# EAGLE design working (EAGLE 7.7.0)
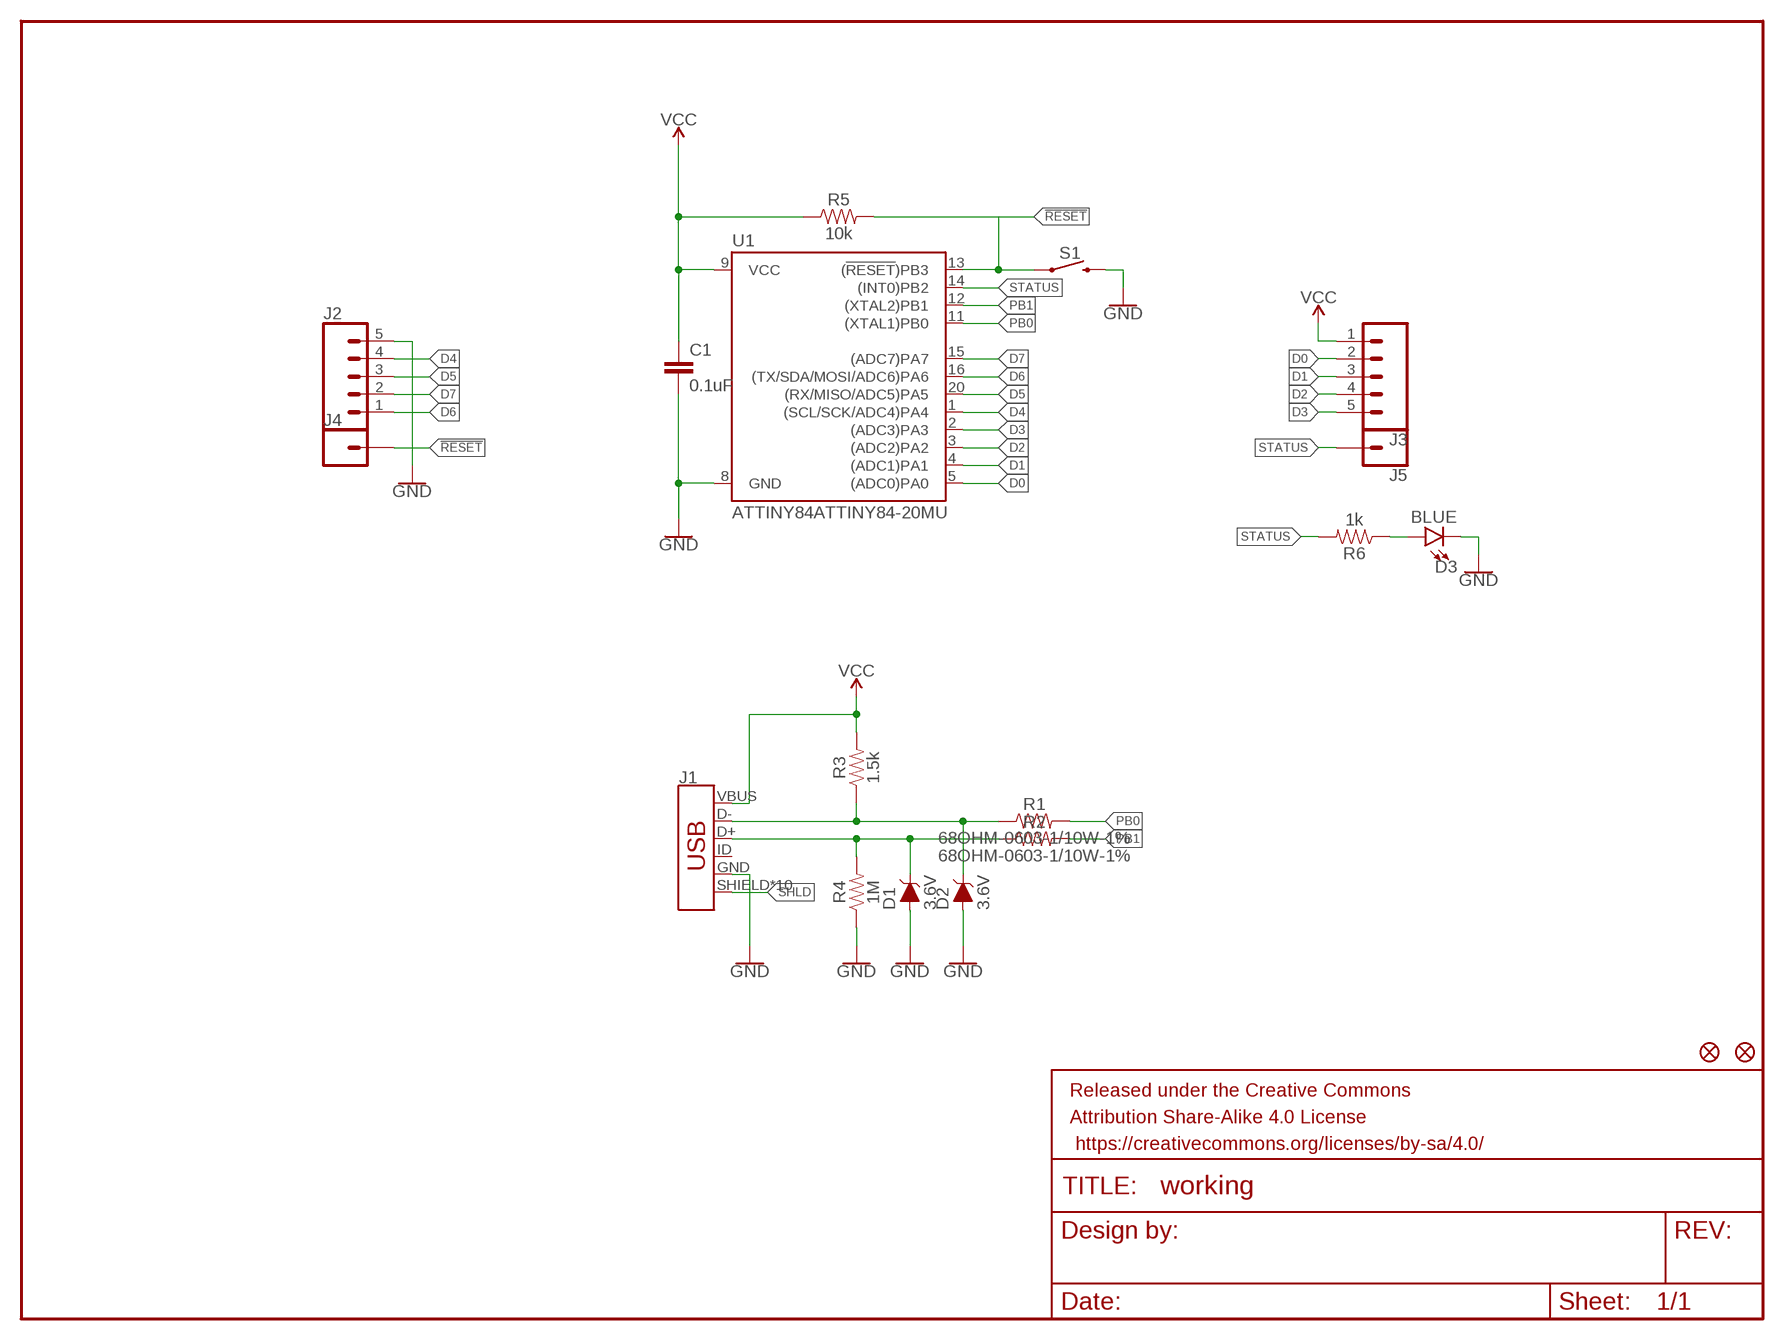
[diagram p0: schematic, sheet 1]

## Parts
C1  0.1uF  0.1UF-0603-25V-(+80/-20%)  [0603]
D1  3.6V  DIODE-ZENER-BZT52C3V6S  [SOD-323]
D2  3.6V  DIODE-ZENER-BZT52C3V6S  [SOD-323]
D3  BLUE  LED-BLUE0603  [LED-0603]
FD1  FIDUCIALUFIDUCIAL  [FIDUCIAL-MICRO]
FD2  FIDUCIALUFIDUCIAL  [FIDUCIAL-MICRO]
FRAME1  FRAME-LETTER  [CREATIVE_COMMONS]
J1  USB_MICRO-B_HALF_PTH_MILL  [USB-MICROB-PTH-MILL]
J2  CONN_05NO_SILK  [1X05_NO_SILK]
J3  CONN_05NO_SILK  [1X05_NO_SILK]
J4  CONN_01PTH_NO_SILK_YES_STOP  [1X01_NO_SILK]
J5  CONN_01PTH_NO_SILK_YES_STOP  [1X01_NO_SILK]
R1  68OHM-0603-1/10W-1%  [0603]
R2  68OHM-0603-1/10W-1%  [0603]
R3  1.5k  1.5KOHM-0603-1/10W-1%  [0603]
R4  1M  1MOHM-0603-1/4W-5%  [0603]
R5  10k  10KOHM-0603-1/10W-1%  [0603]
R6  1k  1KOHM-0603-1/10W-1%  [0603]
S1  MOMENTARY-SWITCH-SPST-SMD-6.0X3.5MM  [TACTILE_SWITCH_SMD_6.0X3.5MM]
U1  ATTINY84ATTINY84-20MU  [QFN20]

## Nets
!RESET: J4.1 R5.2 S1.1 U1.13((!RESET!)PB3)
D0: J3.2 U1.5((ADC0)PA0)
D1: J3.3 U1.4((ADC1)PA1)
D2: J3.4 U1.3((ADC2)PA2)
D3: J3.5 U1.2((ADC3)PA3)
D4: J2.4 U1.1((SCL/SCK/ADC4)PA4)
D5: J2.3 U1.20((RX/MISO/ADC5)PA5)
D6: J2.1 U1.16((TX/SDA/MOSI/ADC6)PA6)
D7: J2.2 U1.15((ADC7)PA7)
D+: D1.C J1.D+ R2.1 R4.2
D-: D2.C J1.D- R1.1 R3.1
GND: C1.2 D1.A D2.A D3.C J1.GND J2.5 R4.1 S1.2 U1.8(GND)
N$3: D3.A R6.1
PB0: R1.2 U1.11((XTAL1)PB0)
PB1: R2.2 U1.12((XTAL2)PB1)
SHLD: J1.SHIELD J1.SHIELD2(SHIELD) J1.SHIELD3(SHIELD) J1.SHIELD4(SHIELD) J1.SHIELD5(SHIELD) J1.SHIELD6(SHIELD) J1.SHIELD7(SHIELD) J1.SHIELD8(SHIELD) J1.SHIELD9(SHIELD) J1.SHIELD10(SHIELD)
STATUS: J5.1 R6.2 U1.14((INT0)PB2)
VCC: C1.1 J1.VBUS J3.1 R3.2 R5.1 U1.9(VCC)
Unconnected: J1.ID

## Library data of the parts
C1 = SparkFun-Capacitors:0.1UF: 0.1µF ceramic capacitors A capacitor is a passive two-terminal electrical component used to store electrical energy temporarily in an electric field.; PROD_ID: CAP-00810
D1 D2 = SparkFun-DiscreteSemi:DIODE-ZENER: Zener Diode A Zener diode allows current to flow from its anode to its cathode like a normal semiconductor diode, but it also permits current to flow in the reverse direction when its "Zener voltage" is reached. - WIkipedia; PROD_ID: DIO-08199
D3 = SparkFun-LED:LED-BLUE: Blue SMD LED Used in manufacturing of various products at SparkFun Packages: 0603 - SMD 0603 package [Product Link] <http://www.digikey.com/product-detail/en/SMLE12BC7TT86/511-1589-2-ND/1641808> 1206 - SMD1206 package [Product Link] <http://www.digikey.com/product-detail/en/lite-on-inc/LTST-C150TBKT/160-1643-1-ND/573584> SparkFun Products: ESP8266 Thing-Dev Board <https://www.sparkfun.com/products/13711> RedBoard <https://www.sparkfun.com/products/12757>; PROD_ID: DIO-08575
FD1 FD2 = SparkFun-Aesthetics:FIDUCIAL: Fiducial Alignment Points Point-of-reference for pick-and-place machines and other optical instruments.
FRAME1 = SparkFun-Aesthetics:FRAME-LETTER: Schematic Frame - Letter Standard 8.5x11 US Letter frame
J1 = SparkFun-Connectors:USB_MICRO-B: USB Type Micro-B Connector Male/female and PTH/SMT variants SparkFun Products: SparkFun microB USB Breakout <https://www.sparkfun.com/products/12035> SparkFun USB microB Plug Breakout <https://www.sparkfun.com/products/10031> SparkFun ESP8266 Thing <https://www.sparkfun.com/products/13231>; PROD_ID: CONN-13711
J2 J3 = SparkFun-Connectors:CONN_05: Multi connection point. Often used as Generic Header-pin footprint for 0.1 inch spaced/style header connections On any of the 0.1 inch spaced packages, you can populate with these: Break Away Headers - Straight <https://www.sparkfun.com/products/116> (PRT-00116) Break Away Male Headers - Right Angle <https://www.sparkfun.com/products/553> (PRT-00553) Female Headers <https://www.sparkfun.com/products/115> (PRT-00115) Break Away Headers - Machine Pin <https://www.sparkfun.com/products/117> (PRT-00117) Break Away Female Headers - Swiss Machine Pin <https://www.sparkfun.com/products/743> (PRT-00743) For SCREWTERMINALS and SPRING TERMINALS visit here: Screw Terimnals on SparkFun.com <https://www.sparkfun.com/search/results?term=Screw+Terminals> (5mm/3.5mm/2.54mm spacing) This device is also useful as a general connection point to wire up your design to another part of your project. Our various solder wires solder well into these plated through hole pads. Hook-Up Wire - Assortment (Stranded, 22 AWG) <https://www.sparkfun.com/products/11375> (PRT-11375) Hook-Up Wire - Assortment (Solid Core, 22 AWG) <https://www.sparkfun.com/products/11367> (PRT-11367) View the entire wire category on our website here <https://www.sparkfun.com/categories/141> Special notes: Molex polarized connector foot print use with SKU : PRT-08231 with associated crimp pins and housings. 1MM SMD Version SKU: PRT-10208
J4 J5 = SparkFun-Connectors:CONN_01: Single connection point. Often used as Generic Header-pin footprint for 0.1 inch spaced/style header connections On any of the 0.1 inch spaced packages, you can populate with these: Break Away Headers - Straight <https://www.sparkfun.com/products/116> (PRT-00116) Break Away Male Headers - Right Angle <https://www.sparkfun.com/products/553> (PRT-00553) Female Headers <https://www.sparkfun.com/products/115> (PRT-00115) Break Away Headers - Machine Pin <https://www.sparkfun.com/products/117> (PRT-00117) Break Away Female Headers - Swiss Machine Pin <https://www.sparkfun.com/products/743> (PRT-00743) This device is also useful as a general connection point to wire up your design to another part of your project. Our various solder wires solder well into these plated through hole pads. Hook-Up Wire - Assortment (Stranded, 22 AWG) <https://www.sparkfun.com/products/11375> (PRT-11375) Hook-Up Wire - Assortment (Solid Core, 22 AWG) <https://www.sparkfun.com/products/11367> (PRT-11367) View the entire wire category on our website here <https://www.sparkfun.com/categories/141> Special notes: SMTSO-256-ET is a "flush mount" nut for a 4-40 screw. We mostly use this on specialty testbeds; it is a nice way to connect hardware to your PCB at an adjustable hieght. Also note, the SNAP packages are for using a snappable style connector. We sell a baggie of snaps and they are also used on two LilyPad designs: Snap Assortment - 30 pack (male and female) <https://www.sparkfun.com/products/11347> (DEV-11347) LilyPad Arduino SimpleSnap <https://www.sparkfun.com/products/10941> (DEV-10941) LilyPad SimpleSnap Protoboard <https://www.sparkfun.com/products/10940> (DEV-10940)
R1 R2 = SparkFun-Resistors:68OHM: 68Ω resistor A resistor is a passive two-terminal electrical component that implements electrical resistance as a circuit element. Resistors act to reduce current flow, and, at the same time, act to lower voltage levels within circuits. - Wikipedia
R3 = SparkFun-Resistors:1.5KOHM: 1.5kΩ resistor A resistor is a passive two-terminal electrical component that implements electrical resistance as a circuit element. Resistors act to reduce current flow, and, at the same time, act to lower voltage levels within circuits. - Wikipedia; PROD_ID: RES-08306
R4 = SparkFun-Resistors:1MOHM: 1MΩ resistor A resistor is a passive two-terminal electrical component that implements electrical resistance as a circuit element. Resistors act to reduce current flow, and, at the same time, act to lower voltage levels within circuits. - Wikipedia; PROD_ID: RES-07868
R5 = SparkFun-Resistors:10KOHM: 10kΩ resistor A resistor is a passive two-terminal electrical component that implements electrical resistance as a circuit element. Resistors act to reduce current flow, and, at the same time, act to lower voltage levels within circuits. - Wikipedia; PROD_ID: RES-00824
R6 = SparkFun-Resistors:1KOHM: 1kΩ resistor A resistor is a passive two-terminal electrical component that implements electrical resistance as a circuit element. Resistors act to reduce current flow, and, at the same time, act to lower voltage levels within circuits. - Wikipedia; PROD_ID: RES-07856
S1 = SparkFun-Switches:MOMENTARY-SWITCH-SPST: Momentary Switch (Pushbutton) - SPST Normally-open (NO) SPST momentary switches (buttons, pushbuttons). Variants PTH-12MM - 12mm square, through-hole Momentary Pushbutton Switch - 12mm Square <https://www.sparkfun.com/products/9190> (COM-09190) PTH-6.0MM, PTH-6.0MM-KIT - 6.0mm square, through-hole Mini Pushbutton Switch <https://www.sparkfun.com/products/97> (COM-00097) KIT package intended for soldering kit's - only one side of pads' copper is exposed. PTH-RIGHT-ANGLE-KIT - Right-angle, through-hole Right Angle Tactile Button <https://www.sparkfun.com/products/10791> - Used on SparkFun BigTime Watch Kit <https://www.sparkfun.com/products/11734> SMD-12MM - 12mm square, surface-mount Tactile Button - SMD (12mm) <https://www.sparkfun.com/products/12993> (COM-12993) Used on SparkFun PicoBoard <https://www.sparkfun.com/products/11888> SMD-4.5MM - 4.5mm Square Trackball Switch Used on SparkFun Blackberry Trackballer Breakout <https://www.sparkfun.com/products/13169> SMD-4.6MMX2.8MM - 4.60mm x 2.80mm, surface mount Used on SparkFun SAMD21 Mini Breakout <https://www.sparkfun.com/products/13664> SMD-5.2MM, SMD-5.2-REDUNDANT - 5.2mm square, surface-mount Mini Pushbutton Switch - SMD <https://www.sparkfun.com/products/8720> (COM-08720) Used on Arduino Pro Mini <https://www.sparkfun.com/products/11114> REDUNDANT package connects both switch circuits together SMD-6.0X3.5MM - 6.0 x 3.5mm, surface mount Momentary Reset Switch SMD <https://www.sparkfun.com/products/8229> (COM-08229) SMD-6.2MM-TALL - 6.2mm square, surface mount Tactile Button - SMD (6mm) <https://www.sparkfun.com/products/12992> Used on SparkFun Digital Sandbox <https://www.sparkfun.com/products/12651> SMD-RIGHT-ANGLE - Right-angle, surface mount Used on SparkFun Block for Intel® Edison - Arduino <https://www.sparkfun.com/products/13036>; PROD_ID: SWCH-00815; SF_SKU: COM-08229
U1 = SparkFun-IC-Microcontroller:ATTINY84: Atmel 14-pin 2/4/8kB flash uC Datasheet <https://cdn.sparkfun.com/datasheets/Widgets/doc8006.pdf> SparkFun Products Tiny AVR Programmer <https://www.sparkfun.com/products/11801> (PGM-11801) SparkFun Servo Trigger - Continuous Rotation <https://www.sparkfun.com/products/13872> (WIG-13872) SparkFun Servo Trigger <https://www.sparkfun.com/products/13118> (WIG-13118)

## Board
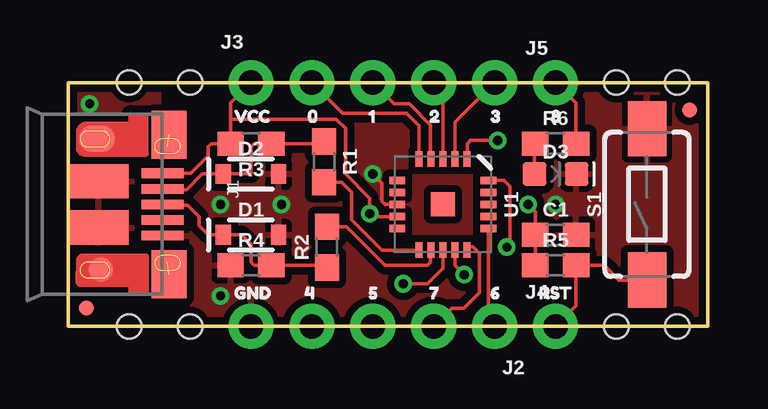
[diagram p1: board, top side]
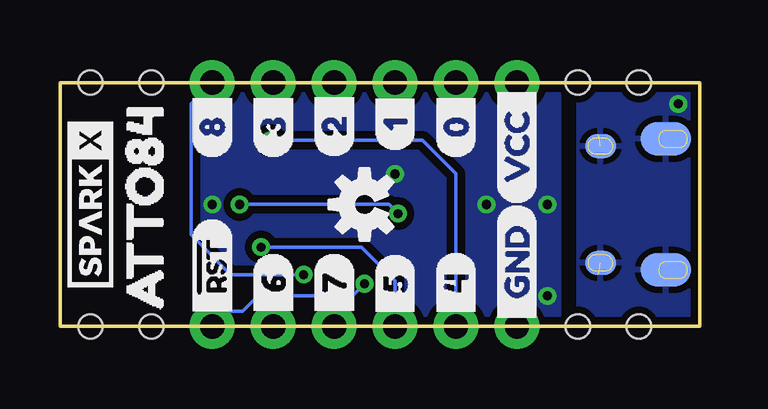
[diagram p2: board, bottom side, seen from below]

Size 26.67 x 10.16 mm. Coordinates in mm from the lower left corner, seen from the top.
Outline: 0,0 0,10.16 26.67,10.16 26.67,0 0,0
Copper layers (1*16): Top 0.035mm / dielectric 1.5mm / Bottom 0.035mm
Design rules "SparkFun-2-layer-PCBWay-LIMIT": minimum track width 6mil, minimum drill 0.3mm, track to track 6mil, track to pad 6mil, pad to pad 6mil, via to via 6mil, smd to smd 6mil, copper to edge 6mil, drill to drill 6mil, minimum pad ring 7mil, minimum via ring 7mil, stop-mask expansion 4mil, vias tented up to drill 25mil, thermal gap 10mil
Holes 1.02 mm at 5.08,10.16 2.54,10.16 2.54,0 5.08,0 22.86,0 25.4,0 25.4,10.16 22.86,10.16

### Footprints (pad centres in the part's own frame; a part is rotated, then mirrored left to right if it is on the bottom)
0603 = smd 1.1 x 1: 1 -0.85,0; 2 0.85,0
SOD-323 = smd 0.63 x 0.83: A 1.15,0; C -1.15,0
LED-0603 = smd 1 x 1: A -0.877,0; C 0.877,0
FIDUCIAL-MICRO = smd 0.635 x 0.635: 1 0,0
USB-MICROB-PTH-MILL = smd 0.4 x 1.75: D+ 0,0; D- -0.65,0; GND 1.3,0; ID 0.65,0; VBUS -1.3,0 | smd 2 x 1.46: SHIELD -2.9,0.275; SHIELD2 2.9,0.275 | smd 1.425 x 2.5: SHIELD3 -0.963,-2.675; SHIELD4 0.963,-2.675 | smd 1.4 x 2.1 bottom: SHIELD5 -2.731,-2.531; SHIELD7 2.729,-2.531 | smd 1 x 1: SHIELD6 2.7,-2.575 | smd 1.1 x 1.5: SHIELD8 -2.731,-2.731 | smd 1 x 1.3 bottom: SHIELD9 -2.43,0.195; SHIELD10 2.43,0.195
1X05_NO_SILK = drill 1.016 pad 1.88: 1 0,0; 2 2.54,0; 3 5.08,0; 4 7.62,0; 5 10.16,0
1X01_NO_SILK = drill 1.016 pad 1.88: 1 0,0
TACTILE_SWITCH_SMD_6.0X3.5MM = smd 2.3 x 1.6: 1 -3.15,0; 2 3.15,0
QFN20 = smd 1 x 1: 0 0,0 | smd 0.65 x 0.3: 1 -1.9,1; 2 -1.9,0.5; 3 -1.9,0; 4 -1.9,-0.5; 5 -1.9,-1; 11 1.9,-1; 12 1.9,-0.5; 13 1.9,0; 14 1.9,0.5; 15 1.9,1 | smd 0.3 x 0.65: 6 -1,-1.9; 7 -0.5,-1.9; 8 0,-1.9; 9 0.5,-1.9; 10 1,-1.9; 16 1,1.9; 17 0.5,1.9; 18 0,1.9; 19 -0.5,1.9; 20 -1,1.9

### Placement (x,y rotation side)
C1  20.32,3.81 0 top
D1  7.62,3.81 0 top
D2  7.62,6.35 0 top
D3  20.32,6.35 0 top
FD1  25.91,9.02 0 top
FD2  0.76,0.76 0 top
FRAME1  -19.05,-11.43 0 top  (outside the outline)
J1  3.94,5.08 270 top
J2  17.78,0 180 top
J3  7.62,10.16 0 top
J4  20.32,0 0 top
J5  20.32,10.16 0 top
R1  10.67,6.86 270 top
R2  10.79,3.3 90 top
R3  7.62,7.62 180 top
R4  7.62,2.54 0 top
R5  20.32,2.54 0 top
R6  20.32,7.62 0 top
S1  24.13,5.08 90 top
U1  15.62,5.08 270 top
U$1  [00]  9.53,8.76 0 top
U$2  [11]  12.06,8.76 0 top
U$3  [22]  14.61,8.76 0 top
U$4  [33]  17.14,8.76 0 top
U$5  [44]  9.4,1.4 0 top
U$6  [55]  12.06,1.4 0 top
U$7  [66]  17.14,1.4 0 top
U$8  [77]  14.61,1.4 0 top
U$9  [RST8]  19.18,1.4 0 top
U$10  [VCC10]  6.48,8.76 0 top
U$11  [GND9]  6.48,1.4 0 top
U$12  [81]  19.68,8.76 0 top
U$13  [ATTO8411]  23.15,-0.66 90 bottom
U$14  [SPARKX-SMALL]  25.4,5.08 90 bottom
U$15  [_#RST0]  20.32,0 90 bottom
U$16  [_42]  10.16,0.13 90 bottom
U$17  [_53]  12.7,0.13 90 bottom
U$18  [_64]  17.78,0.13 90 bottom
U$19  [_75]  15.24,0.13 90 bottom
U$20  [_GND1]  7.62,-0.13 90 bottom
U$21  [VCC_5]  7.62,5.08 90 bottom
U$22  [0_4]  10.16,6.99 90 bottom
U$23  [1_3]  12.7,7.24 90 bottom
U$24  [2_2]  15.24,6.99 90 bottom
U$25  [3_1]  17.78,6.99 90 bottom
U$26  [8_0]  20.32,6.99 90 bottom
U$27  [OSHW-LOGO-S]  13.97,5.08 90 bottom

### Tracks (layer width: path | path; a pad name or v marks a point on that pad's centre or on a via)
!RESET  (via drill 0.38)
  Top 0.152: S1.1 22.96,1.93 22.35,2.54 R5.2 21.17,0.85 J4.1 | U1.13 15.62,2.41 14.99,1.78 v13.97,1.78
  Bottom 0.152: v13.97,1.78 14.48,1.27 18.41,1.27 19.05,0.64 19.68,0.64 J4.1
D0
  Top 0.152: U1.5 14.62,8.37 14.1,8.89 11.43,8.89 J3.2
D1
  Top 0.152: J3.3 13.59,9.27 14.22,9.27 15.11,8.38 U1.4
D2
  Top 0.152: U1.3 15.62,9.78 J3.4
D3
  Top 0.152: U1.2 16.12,8.5 J3.5
D4  (via drill 0.38)
  Top 0.152: v17.91,7.75 16.76,7.75 16.64,7.62 16.64,7 U1.1
  Bottom 0.152: v17.91,7.75 11.56,7.75 10.16,6.35 J2.4
D5  (via drill 0.38)
  Top 0.152: U1.20 18.18,6.08 18.41,5.84 18.41,3.43 v18.29,3.3
  Bottom 0.152: v18.29,3.3 14.1,3.3 12.7,1.91 J2.3
D6
  Top 0.152: U1.16 17.52,0.26 J2.1
D7
  Top 0.152: U1.15 16.62,3.32 16.88,3.32 17.14,3.05 17.14,1.4 16.51,0.76 16,0.76 J2.2
D+
  Top 0.152: R2.1 10.71,2.54 R4.2 7.75,2.54 7.62,2.67 7.62,3.43 7.24,3.81 D1.C 5.84,3.81 5.46,4.19 5.46,4.57 4.98,5.05 3.97,5.05 J1.D+
D-
  Top 0.152: R1.1 10.58,7.62 R3.1 7.75,7.62 7.62,7.49 7.62,6.35 D2.C 5.59,6.35 4.94,5.7 3.97,5.7 J1.D-
GND  (via drill 0.38)
  Top 0.152: U1.8 13.21,5.08 13.08,5.21 13.08,5.97 v12.7,6.35
  other vias: 8.89,5.08 6.35,1.27 6.35,5.08 20.32,5.08
  pour Bottom (isolate 0.305): 5.84,10.16 26.67,10.16 26.67,0 5.84,0
  pour Top (isolate 0.305): 4.45,10.16 26.67,10.16 26.67,0 4.45,0
N$3
  Top 0.152: D3.A 19.44,7.59 R6.1
PB0
  Top 0.152: R1.2 11.39,6.01 11.81,5.59 11.81,4.45 13.08,3.17 U1.11
PB1
  Top 0.152: R2.2 11.6,4.15 13.21,2.54 14.99,2.54 15.11,2.67 U1.12
SHLD  (via drill 0.38)  (2 unrouted)
  other vias: 0.89,9.27
  pour Bottom (isolate 0.305): 0,10.16 5.08,10.16 5.08,0 0,0
  pour Top (isolate 0.305): 0,10.16 3.81,10.16 3.81,0 0,0
STATUS  (via drill 0.38)
  Top 0.152: R6.2 21.17,9.31 J5.1 | U1.14 16.12,2.55 v16.51,2.16
  Bottom 0.152: J5.1 21.21,9.27 21.21,3.81 19.56,2.16 v16.51,2.16
VCC  (via drill 0.38)
  Top 0.152: R5.1 C1.1 19.47,4.79 v19.18,5.08 | 6.77,8.64 R3.2 5.97,7.62 5.84,7.49 5.84,7.11 5.11,6.38 J1.VBUS | 6.77,8.64 6.77,9.31 J3.1 | 6.77,8.64 11.18,8.64 11.56,8.26 11.56,6.35 12.57,5.33 v12.57,4.7 12.7,4.57 U1.9
  Bottom 0.152: v19.18,5.08 12.95,5.08 v12.57,4.7

### Text on the board
tDocu: N.Poole